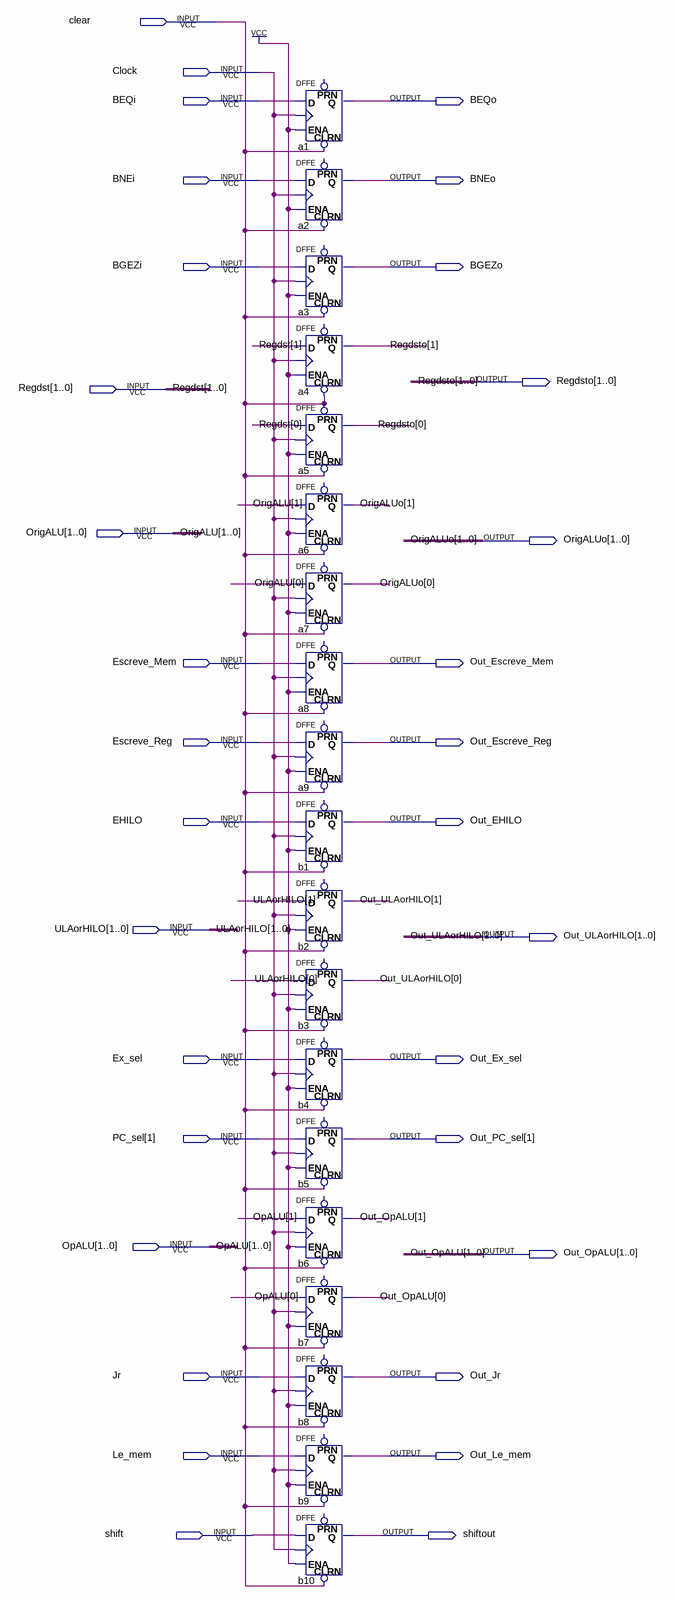
[diagram p0: schematic sheet]
// Quartus schematic ID_EX_cont.bdf as structural Verilog: 19 symbols, 32 pins
module ID_EX_cont (
  input  clear,
  input  Clock,
  input  BEQi,
  input  BNEi,
  input  BGEZi,
  input  [1:0] Regdst,
  input  [1:0] OrigALU,
  input  Escreve_Mem,
  input  Escreve_Reg,
  input  EHILO,
  input  [1:0] ULAorHILO,
  input  Ex_sel,
  input  [1:1] PC_sel,
  input  [1:0] OpALU,
  input  Jr,
  input  Le_mem,
  input  shift,
  output BEQo,
  output BNEo,
  output BGEZo,
  output [1:0] Regdsto,
  output [1:0] OrigALUo,
  output Out_Escreve_Mem,
  output Out_Escreve_Reg,
  output Out_EHILO,
  output [1:0] Out_ULAorHILO,
  output Out_Ex_sel,
  output [1:1] Out_PC_sel,
  output [1:0] Out_OpALU,
  output Out_Jr,
  output Out_Le_mem,
  output shiftout
);

  DFFE a1 (.CLRN(clear), .D(BEQi), .CLK(Clock), .ENA(1'b1), .Q(BEQo));  // open: PRN
  DFFE a2 (.CLRN(clear), .D(BNEi), .CLK(Clock), .ENA(1'b1), .Q(BNEo));  // open: PRN
  DFFE a3 (.CLRN(clear), .D(BGEZi), .CLK(Clock), .ENA(1'b1), .Q(BGEZo));  // open: PRN
  DFFE a4 (.CLRN(clear), .D(Regdst[1]), .CLK(Clock), .ENA(1'b1), .Q(Regdsto[1]));  // open: PRN
  DFFE a5 (.PRN(clear), .CLRN(clear), .D(Regdst[0]), .CLK(Clock), .ENA(1'b1), .Q(Regdsto[0]));
  DFFE a6 (.CLRN(clear), .D(OrigALU[1]), .CLK(Clock), .ENA(1'b1), .Q(OrigALUo[1]));  // open: PRN
  DFFE a7 (.CLRN(clear), .D(OrigALU[0]), .CLK(Clock), .ENA(1'b1), .Q(OrigALUo[0]));  // open: PRN
  DFFE a8 (.CLRN(clear), .D(Escreve_Mem), .CLK(Clock), .ENA(1'b1), .Q(Out_Escreve_Mem));  // open: PRN
  DFFE a9 (.CLRN(clear), .D(Escreve_Reg), .CLK(Clock), .ENA(1'b1), .Q(Out_Escreve_Reg));  // open: PRN
  DFFE b1 (.CLRN(clear), .D(EHILO), .CLK(Clock), .ENA(1'b1), .Q(Out_EHILO));  // open: PRN
  DFFE b2 (.CLRN(clear), .D(ULAorHILO[1]), .CLK(Clock), .ENA(1'b1), .Q(Out_ULAorHILO[1]));  // open: PRN
  DFFE b3 (.CLRN(clear), .D(ULAorHILO[0]), .CLK(Clock), .ENA(1'b1), .Q(Out_ULAorHILO[0]));  // open: PRN
  DFFE b4 (.CLRN(clear), .D(Ex_sel), .CLK(Clock), .ENA(1'b1), .Q(Out_Ex_sel));  // open: PRN
  DFFE b5 (.CLRN(clear), .D(PC_sel[1]), .CLK(Clock), .ENA(1'b1), .Q(Out_PC_sel[1]));  // open: PRN
  DFFE b6 (.CLRN(clear), .D(OpALU[1]), .CLK(Clock), .ENA(1'b1), .Q(Out_OpALU[1]));  // open: PRN
  DFFE b7 (.CLRN(clear), .D(OpALU[0]), .CLK(Clock), .ENA(1'b1), .Q(Out_OpALU[0]));  // open: PRN
  DFFE b8 (.CLRN(clear), .D(Jr), .CLK(Clock), .ENA(1'b1), .Q(Out_Jr));  // open: PRN
  DFFE b9 (.CLRN(clear), .D(Le_mem), .CLK(Clock), .ENA(1'b1), .Q(Out_Le_mem));  // open: PRN
  DFFE b10 (.CLRN(clear), .D(shift), .CLK(Clock), .ENA(1'b1), .Q(shiftout));  // open: PRN
endmodule
